# Altium project ReceiverSide.PrjPcb
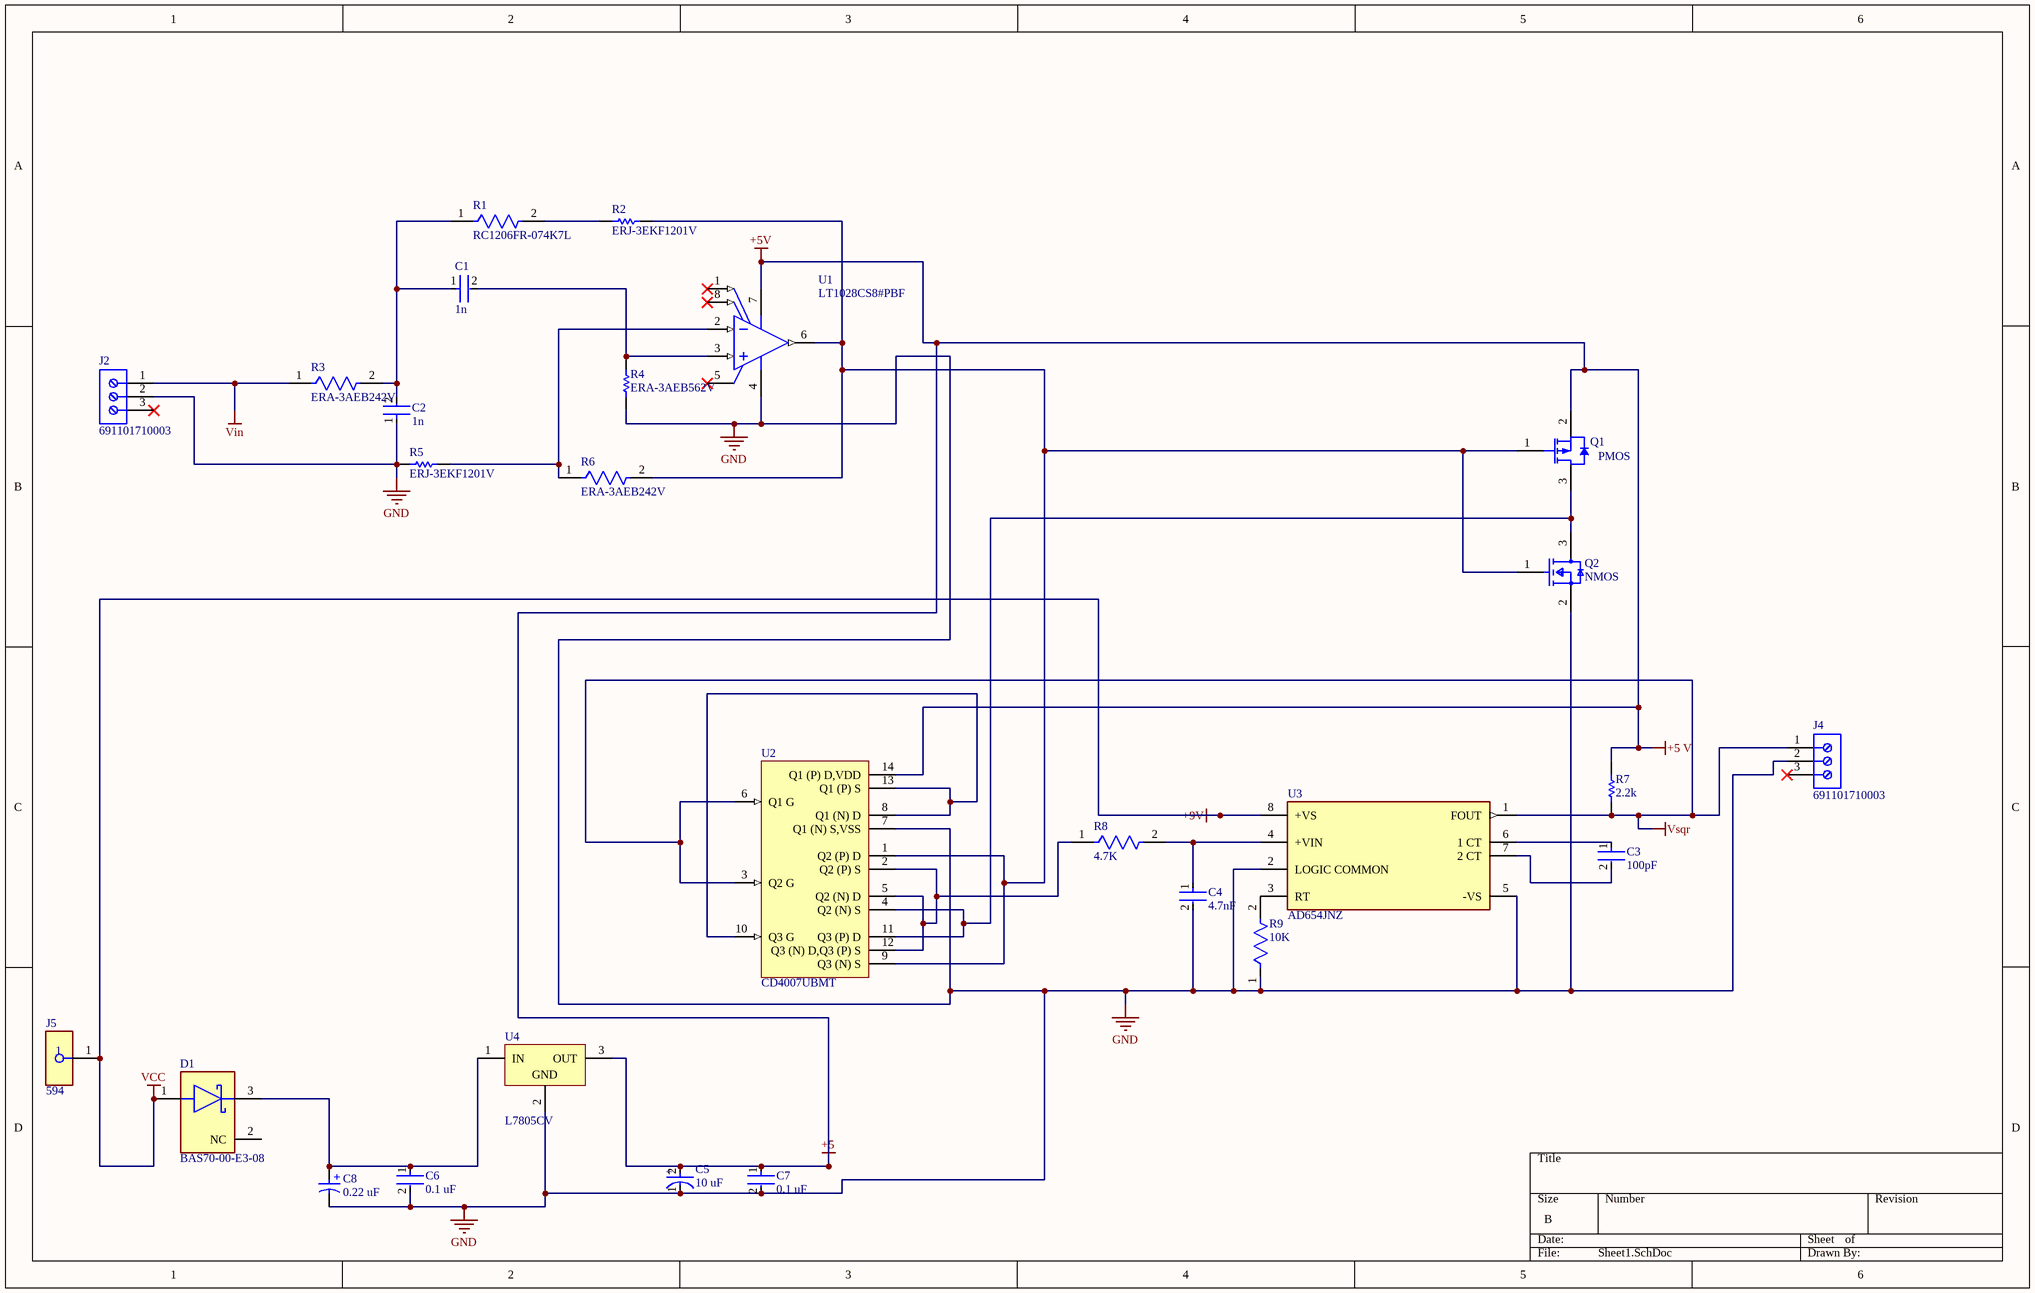
[diagram p0: Sheet1.SchDoc]
1 sheet, 27 parts. Net scope: global (net labels, ports and power ports of the same name join across sheets).
Board file: PCB1.PcbDoc

## Sheet Sheet1.SchDoc
size B; SheetNumber: 1; SheetTotal: 1

### Parts
C1  1n  [FP-0603-L_1_6_0_15-W_0_81-IPC_A]
C2  1n  [FP-0603-L_1_6_0_15-W_0_81-IPC_A]
C3  100pF  [FP-C0402-BB-MFG]
C4  4.7nF  [FP-1206-L_3_2_0_2-W_1_6_0-IPC_B]
C5  10 uF  [FP-RAD-TH-D_5_0_5-L_11_1-MFG]
C6  0.1 uF  [FP-RDE0P1-MFG]
C7  0.1 uF  [FP-RDE0P1-MFG]
C8  0.22 uF  [WCAP-ATG8_D5H11]
D1  BAS70-00-E3-08  [FP-6_541-5014_01-4-MFG]
J2  691101710003  [691101710003]
J4  691101710003  [691101710003]
J5  594  [FP-594-MFG]
Q1  PMOS  [INF-SOT23_L]
Q2  NMOS  [FP-318-08-IPC_B]
R1  RC1206FR-074K7L  [FP-RC1206-0_65-IPC_B]
R2  ERJ-3EKF1201V  [RESC1609X55X30ML15T15]
R3  ERA-3AEB242V  [FP-ERA3A-MFG]
R4  ERA-3AEB562V  [RESC1608X55X30NL20T20]
R5  ERJ-3EKF1201V  [RESC1609X55X30ML15T15]
R6  ERA-3AEB242V  [FP-ERA3A-MFG]
R7  2.2k  [RESC1608X55X25LL10T15]
R8  4.7K  [FP-CRCW0402-e3-IPC_A]
R9  10K  [FP-ERA3A-IPC_C]
U1  LT1028CS8#PBF  [LT-S8-8_M]
U2  CD4007UBMT  [D0014A_N]
U3  AD654JNZ  [FP-N-8-MFG]
U4  L7805CV  [TO220]

### Nets
+5: C5.2(A) C7.1 Q1.2(SOURCE) R7.2 U1.7(V+) U2.14(Q1_(P)_D,VDD) U4.3(OUT)  [also labelled +5 V, +5V]
+9V: D1.1(A) J5.1 U3.8(+VS)  [also labelled VCC]
GND: C2.1 C4.2 C5.1(C) C6.2 C7.2 C8.2(N) J2.2 J4.2 Q2.2(S) R4.1 R5.1 R9.1 U1.4(V-) U2.7(Q1_(N)_S,VSS) U3.2(LOGIC_COMMON) U3.5(-VS) U4.2(GND)
Vin: J2.1 R3.1
Vsqr: J4.1 R7.1 U2.3(Q2_G) U2.6(Q1_G) U3.1(FOUT)
NetC1_1: C1.1 C2.2 R1.1 R3.2
NetC1_2: C1.2 R4.2 U1.3(+IN)
NetC3_1: C3.1 U3.6(1_CT)
NetC3_2: C3.2 U3.7(2_CT)
NetC4_1: C4.1 R8.2 U3.4(+VIN)
NetC6_1: C6.1 C8.1(P) D1.3(C) U4.1(IN)
NetQ1_1: Q1.1(GATE) Q2.1(G) R2.2 R6.2 U1.6(OUT) U2.1(Q2_(P)_D) U2.9(Q3_(N)_S)
NetQ1_3: Q1.3(DRAIN) Q2.3(D) U2.4(Q2_(N)_S) U2.11(Q3_(P)_D)
NetR1_2: R1.2 R2.1
NetR5_2: R5.2 R6.1 U1.2(-IN)
NetR8_1: R8.1 U2.2(Q2_(P)_S) U2.5(Q2_(N)_D) U2.12(Q3_(N)_D,Q3_(P)_S)
NetR9_2: R9.2 U3.3(RT)
NetU2_8: U2.8(Q1_(N)_D) U2.10(Q3_G) U2.13(Q1_(P)_S)

Not connected (* = marked no-connect by the designer): D1 2(NC); J2 3*; J4 3*; U1 1(VOS_TRIM)* 5(OVERCOMP)* 8(VOS_TRIM)*

### Notes on the sheet
- (in symbol CMP-03913-54007281-1) +
- (in symbol CMP-05427-001295-1) +

### Library data of the parts
C1 C2 = CMP-2006-04378-2: General Purpose Ceramic Capacitor, 0603, 1nF, 10%, X7R, 15%, 50V; Case Code (Metric): 1608; Min Operating Temperature: -55°C; Weight: 7.1E-05oz; Series: -; Capacitance: 1nF; RoHS Compliant: Yes; Radiation Hardening: No; Height: 0.9mm; Mount: Surface Mount; REACH SVHC: No SVHC; Lead Free: Lead Free; Depth: 0.81mm; Voltage: 50V; Number of Pins: 2; Voltage Rating: 50V; Max Operating Temperature: 125°C; Termination: SMD/SMT; Construction: Flat; Case Code (Imperial): 0603; Dielectric: X7R; Width: 0.032inch; Tolerance: 10%; Case/Package: 0603; Contact Plating: Tin; Packaging: Tape and Reel; Voltage Rating (DC): 50V; Dielectric Material: Ceramic; Package Quantity: 4000; Thickness: 0.035inch; Length: 1.6mm
C3 = CMP-2008-03050-3: CAP CER 100PF 50V 10% NP0 0402; Manufacturer Part Number: C0402C101K5GACTU; Manufacturer: Kemet; Tolerance: 0.1; Temperature Coefficient: 15%; Temperature Characteristic: C0G; Material: Ceramic; Automotive: No; Temperature Range High: +125°C; Device Class L3: Ceramic Capacitors; ComponentLink2Description: Datasheet; Temperature Range Low: -55°C; Height: 0.55mm; Package: C0402-BB; Capacitance: 100 pF; Digikey Description: CAP CER 100PF 50V 10% NP0 0402; RoHS: TRUE; Mouser Description: KEMET - C0402C101K5GACTU - CAP, C0G / NP0, 100PF, 50V, 0402; ComponentLink2URL: https://content.kemet.com/datasheets/KEM_C1002_X7R_SMD.pdf; Value: 100 pF; Category: Cap; Device Class L1: Passive Components; Octopart: https://octopart.com/c0402c101k5gactu-kemet-9144183; Device Class L2: Capacitors; Ipc Land Pattern Name: CAPC10050X50; Temperature: -55°C to +125°C; Voltage Rating: 50 V; Lead Free: Yes
C4 = CMP-04427-001905-1: General Purpose Ceramic Capacitor, 1206, 4.7nF, 10%, X7R, 15%, 100V; Insulation Resistance: 100GR; Dissipation Factor: 2.5%; Case Code (Imperial): 1206; Length: 3.2mm; Voltage Rating: 100V; Packaging: Tape and Reel; Max Operating Temperature: 125°C; Voltage: 100V; Depth: 1.6mm; Weight: 0.000571oz; Capacitance: 4.7nF; Case/Package: 1206; Tolerance: 10%; Number of Pins: 2; Mount: Surface Mount; Min Operating Temperature: -55°C; Lead Free: Lead Free; Thickness: 0.037inch; RoHS Compliant: Yes; Height: 0.94mm; Radiation Hardening: No; Termination: SMD/SMT; Dielectric Material: Ceramic; Dielectric: X7R; Package Quantity: 1; Voltage Rating (DC): 100V; REACH SVHC: No SVHC; Case Code (Metric): 3216; Width: 0.063inch
C5 = CMP-05427-001295-1: Aluminum Electrolytic Capacitors (Radial Lead Type) 10uF ±20% 50V; Lead Diameter: 0.5mm; Life (Hours): 5000Hour; Impedance: 340mR; Ripple Current (AC): 250mA; REACH SVHC: Yes; Tolerance: 20%; Construction: RADIAL; Min Operating Temperature: -40°C; Termination: Radial; Voltage Rating: 50V; Height: 11mm; Max Operating Temperature: 105°C; Capacitance: 10uF; Voltage: 50V; Diameter: 5mm; Lead Pitch: 2mm; Series: FR Radial; RoHS Compliant: Yes; Case/Package: Radial
C6 C7 = CMP-06035-036375-1: Ceramic Capacitor 100nF ±10% 25V X7R Radial; Lead Diameter: 0.5mm; Mount: Through Hole; Resistor Type: Ceramic; Case/Package: Radial; Height - Seated (Max): 0.236inch; Lead Pitch: 0.098inch; Lead Free: Lead Free; Voltage Rating (DC): 25V; Width: 0.098inch; Packaging: Bulk; Dielectric: X7R; Tolerance: 10%; Min Operating Temperature: -55°C; Capacitance: 100nF; Max Operating Temperature: 125°C; Termination: Radial; Height: 3.5mm; Package Quantity: 500; Voltage Rating: 25V; Length: 0.197inch
C8 = CMP-03913-54007281-1: 860010772002 WCAP-ATG8 Aluminum Electrolytic Capacitors; Polarity: Polar; Voltage Rating: 63V; Dissipation Factor: 9%; Tolerance: 20%; Capacitance: 220nF; Leakage Current: 3µA; Pitch: 2mm; Life (Hours): 2000hours; Ripple Current: 4mA; Diameter: 5mm; NexarPartId: 54007281; RoHS: Compliant; Lead Pitch: 2.0066mm; Min Operating Temperature: -40°C; Max Operating Temperature: 85°C; Case/Package: Radial; Height - Seated (Max): 12.4968mm; Mount: Through Hole; Height: 11mm; REACH SVHC: Unknown; Voltage Rating (DC): 63V; Length: 11mm; Packaging: Tape & Box (TB)
D1 = CMP-02539-000005-1: DIODE SCHOTTKY 70V 200MA SOT23; Manufacturer: Vishay; Max Surge Forward Current: 600mA; Peak Reverse Current: 0.02uA; Value: 1.5pF; Max Junction Temp: +125°C; Temperature Range High: +125°C; Device Class L1: Discrete Semiconductors; Height: 1.15mm; Temperature: -55°C to +125°C; Mouser Description: Schottky Diodes & Rectifiers 70 Volt 200mA Single; Manufacturer Part Number: BAS70-00-E3-08; Reverse Voltage: 70V; Device Class L3: Schottky Diodes; Temperature Range Low: -55°C; Package: 6.541-5014.01-4; RoHS: TRUE; Automotive: No; Capacitance: 1.5pF; Max Repetitive Reverse Voltage: 70V; ComponentLink2URL: https://www.vishay.com/docs/85702/bas70.pdf; Category: Diode; Octopart: https://octopart.com/bas70-00-e3-08-vishay-30324832; Forward Current: 200mA; Lead Free: Yes; Device Class L2: Diodes; Digikey Description: DIODE SCHOTTKY 70V 200MA SOT23; ComponentLink2Description: Datasheet
J2 J4 = CMP-1502-03257-2: NexarPartId: 8917705; Voltage Rating: 250V; Current: 16A; Wire Gauge (Min): 14AWG; Pitch: 5.0038mm; Wire Gauge (Max): 26AWG; Number of Positions Per Level: 3; Plating: Steel; Number of Levels: 1; Stripping Length: -7mm; REACH SVHC: Unknown; Width: 16.2mm; Height: 16.4mm; Contact Material: Brass; RoHS: Compliant; Color: Blue; Contact Plating: Tin; Lead Pitch: 5mm; Packaging: Box; Termination: Screw; Number of Contacts: 3; Wire/Cable Gauge: 26AWG; Min Operating Temperature: -40°C; Max Operating Temperature: 105°C; Housing Material: Nylon; Length: 9mm; Voltage: 250V; Mount: Through Hole; Current Rating: 16A; Number of Pins: 3
J5 = CMP-19636-000029-1: BATTERY CONTACT SNAP 9V PC PIN; Body Material: Steel; Material Thickness: 0.15inch; Connector Type: Snap in; Number of Cells: 1; Gender: Female; Body Plating: Tin; Package Quantity: 100; Termination: PC Pin; Thickness: 0.015inch; Reach SVHC Compliant: Yes; RoHS Compliant: Yes; Length: 9.65mm; Contact Plating: Nickel; Contact Type: Snap-In; Material: Steel; Packaging: Bulk; Orientation: Right Angle; Mount: Through Hole; Lead Free: Lead Free; Series: -; Number of Batteries: 1; Contact Material: Steel
Q1 = CMP-2000-05970-1: SIPMOS(R) Small-Signal-Transistor, -0.33 A, 2 Ohm, -60 V, 3-Pin SOT-23, RoHS, Tape and Reel; Manufacturer: Infineon; Package Version: 04/2016; Mounting Technology: SurfaceMount; Manufacturer URL: http://www.infineon.com/; RoHS: Details; Package Description: 3-Pin Small Outline Transistor Package, Body 2.9 x 1.3 mm, Pitch 0.95 mm; Product Category: MOSFET; Datasheet Version: Rev. 1.5, 03/2012; Package Reference: SOT23; Package URL: http://www.infineon.com/dgdl/Infineon-PG-SOT23-3-5_BSS83PH6327XTSA1-PD-v01_00-EN.pdf?fileId=5546d46254e133b40154f1b7e80354af; Packaging: Reel; Datasheet URL: http://media.digikey.com/pdf/Data%20Sheets/Infineon%20PDFs/BSS83P%20H6327.pdf
Q2 = CMP-07173-000101-1: MOSFET N-CH 50V 220MA SOT-23; Turn-Off Delay Time: 20ns; Element Configuration: Single; Rds On Max: 3.5R; Gate to Source Voltage (Vgs): 20V; Threshold Voltage: 1.3V; Number of Elements: 1; Power Dissipation: 360mW; Rise Time: 9ns; Turn-On Delay Time: 2.5ns; Input Capacitance: 27pF; On-State Resistance: 6R; Lead Free: Lead Free; Length: 2.92mm; Width: 1.3mm; Drain to Source Breakdown Voltage: 50V; Min Operating Temperature: -55°C; REACH SVHC: No SVHC; Packaging: Tape and Reel; Radiation Hardening: No; Height: 0.93mm; Drain to Source Voltage (Vdss): 50V; Current Rating: 220mA; Voltage Rating (DC): 50V; Weight: 0.03g; Continuous Drain Current (ID): 220mA; Number of Pins: 3; Nominal Vgs: 1.3V; Max Power Dissipation: 360mW; Fall Time: 9ns; Drain to Source Resistance: 3.5R; Contact Plating: Tin; Case/Package: SOT-23; Package Quantity: 1; Dual Supply Voltage: 50V; Mount: Surface Mount; Termination: SMD/SMT; Max Operating Temperature: 150°C
R1 = CMP-03412-037805-1: RES SMD 4.7K OHM 1% 1/4W 1206; Max Power Dissipation: 250mW; Voltage Rating: 200V; Temperature Coefficient: 100ppm/°C; Resistance: 4.7kR; Construction: Rectangular; RoHS Compliant: Yes; Max Operating Temperature: 155°C; Tolerance: 1%; Height: 0.026inch; Features: Moisture Resistant; Military Standard: Not; Series: RC; Termination: SMD/SMT; Number of Terminations: 2; Number of Pins: 2; Case Code (Imperial): 1206; Case/Package: 1206; Case Code (Metric): 3216; Voltage Rating (DC): 200V; Width: 0.063inch; Min Operating Temperature: -55°C; Resistance Tolerance: 1%; Length: 0.122inch; Size Code: 1206; Lead Free: Lead Free; Depth: 1.6mm; Packaging: Tape and Reel; Package Quantity: 1; Power Rating: 250mW; Resistor Type: Thick Film
R2 R5 = CMP-2000-00214-2: Chip Resistor, 1.2 KOhm, +/- 1%, 0.1 W, -55 to 155 degC, 0603 (1608 Metric), RoHS, Tape and Reel; Manufacturer: Panasonic; Max Power Dissipation: 100mW; Voltage Rating (DC): 75V; Temperature Coefficient: 100ppm/degC; Package Description: 2-Pin Surface Mount Device, Body 1.6 x 0.85 mm; Contact Plating: Tin; Number of Pins: 2; Resistance: 1.2KOhm; Length: 1.6mm; Height: 0.022inch; Number of Terminations: 2; Mount: SurfaceMount; Package Reference: 0603; Packaging: TapeandReel; Case Code (Metric): 1608; Datasheet Version: 42095.0; Datasheet URL: https://industrial.panasonic.com/cdbs/www-data/pdf/RDA0000/AOA0000C283.pdf; Depth: 0.8mm; REACH SVHC: NoSVHC; Case/Package: 0603; Min Operating Temperature: -55degC; Composition: ThickFilm; Manufacturer URL: http://www.panasonic.com/; Termination: SMD/SMT; Package Quantity: 1; Case Code (Imperial): 0603; Width: 0.031inch; Power Rating: 100mW; Voltage Rating: 75V; Lead Free: LeadFree; Package URL: http://www.st.com/st-web-ui/static/active/en/resource/technical/document/datasheet/CD00001320.pdf; RoHSCompliant: True; Tolerance: 1%; Military Standard: Not; Max Operating Temperature: 155degC
R3 R6 = CMP-2000-00965-2: NexarPartId: 1173624; Resistance: 2.4kΩ; Voltage Rating: 75V; Max Power Dissipation: 100mW; Temperature Coefficient: 25ppm/°C; Tolerance: 0.1%; Schedule B: 8533210045, 8533210045; Packaging: Tape & Reel; Case/Package: 0603; Power Rating: 100mW; Composition: Thin Film; Lead Free: Lead Free; Military Standard: Not; REACH SVHC: No SVHC; Radiation Hardening: No; Length: 1.6mm; Max Operating Temperature: 155°C; Number of Pins: 2; Height: 450µm; Mount: Surface Mount; Case Code (Metric): 1608; RoHS: Compliant; Termination: SMD/SMT; Width: 800µm; Min Operating Temperature: -55°C; Voltage Rating (DC): 75V; Depth: 800µm; Case Code (Imperial): 0603; Lifecycle Status: Production; Contact Plating: Tin; Number of Terminations: 2
R4 = CMP-2000-00094-1: Manufacturer: Panasonic; Part Number: ERA-3AEB562V
R7 = CMP-2000-06934-1: Thick Film Resistor, 2.2 KOhm, 100 mW, 50 V, +/- 1%, -55 to 155 degC, 2-Pin SMD (0603), RoHS, Tape and Reel; Manufacturer: Yageo; Resistance: 2.2kOhms; Temperature Coefficient: 100PPM/C; Voltage Rating: 50V; Power Rating: 100mW; Tolerance: 1%; Datasheet Version: Rev. 7, 05/2017; Case Code - mm: 1608; Series: RC; Mounting Technology: SurfaceMount; Package Description: 2-Pin Surface Mount Device, Body 1.6 x 0.8 mm; Case Code - in: 0603; Package Reference: 0603; Product: ThickFilmResistorsGeneralPurpose; Manufacturer URL: http://www.yageo.com/; Termination Style: SMD/SMT; Operating Temperature Range: -55Cto+155C; Datasheet URL: http://www.yageo.com/documents/recent/PYu-RC_Group_51_RoHS_L_7.pdf; Packaging: Reel
R8 = CMP-2002-00052-3: RES Thick Film, 4.7kΩ, 5%, 0.063W, 200ppm/°C, 0402; Power Rating: 63mW; Resistance: 4.7kR; Voltage Rating: 50V; Case Code (Metric): 1005; Case/Package: 0402; Composition: Thick Film; Depth: 0.5mm; Min Operating Temperature: -55°C; Temperature Coefficient: 200ppm/°C; Max Power Dissipation: 63mW; Packaging: Tape and Reel; Max Operating Temperature: 155°C; Number of Terminations: 2; Width: 0.5mm; Height: 0.35mm; Contact Plating: Tin; Package Quantity: 1; Length: 1mm; Termination: SMD/SMT; Radiation Hardening: No; Weight: 2.3E-05oz; Military Standard: Not; Case Code (Imperial): 0402; Features: Automotive AEC-Q200; Tolerance: 5%
R9 = CMP-2000-00874-2: RES SMD 10K OHM 0.1% 1/10W 0603; Voltage Rating (DC): 75V; Power Rating: 100mW; Resistance: 10kR; Temperature Coefficient: 25ppm/°C; Radiation Hardening: No; Width: 0.8mm; Depth: 0.8mm; Construction: Rectangular; Case Code (Metric): 1608; Package Quantity: 5000; Length: 1.6mm; Size Code: 0603; Case Code (Imperial): 0603; Termination: SMD/SMT; Contact Plating: Tin; Resistance Tolerance: 0.1%; Military Standard: Not; Packaging: Tape and Reel; Max Power Dissipation: 100mW; REACH SVHC: No SVHC; Series: ERA-3A; Voltage Rating: 75V; Lead Free: Lead Free; Technology: METAL FILM; RoHS Compliant: Yes; Max Operating Temperature: 155°C; Resistor Type: Thin Film; Min Operating Temperature: -55°C; Number of Pins: 2; Case/Package: 0603; Tolerance: 0.1%; Height: 0.45mm; Mount: Surface Mount; Number of Terminations: 2
U1 = CMP-0359-03082-2: Single Channel, Low Noise, Low Drift Operational Amplifier, 75 MHz Typical GBW, 15 V/us Typical SR, 8 to 44 V, 8-Pin SOIC (S8-8), Commerical, Pb-Free; Linear Technology Part Number: LT1028; Manufacturer: Linear Technology; Is (mA) Typical: 7.4; Channels (#): 1; GBW (MHz) Typical: 75; Vs Min (V): 8; SR (V/us) Typical: 15; Vs Max (V): 44; Vos (mV) Typical: 0.01; ComponentLink2Description: Datasheet; PackageDescription: 8-Pin Plastic Small Outline, Body 4.9 x 3.9 mm, Pitch 1.27 mm; DatasheetVersion: Rev. B; ComponentLink3URL: http://cds.linear.com/docs/en/packaging/05081610_G_SO8.pdf; ComponentLink3Description: Package Specification; ComponentLink2URL: http://cds.linear.com/docs/en/datasheet/1028fb.pdf; RevisionNote: URLs updated; PackageReference: LT-S8-8; Type: VFB; RoHS: Pb-Free; Mounting Technology: Surface Mount; PackageVersion: Rev G; ComponentLink1Description: Manufacturer URL; ComponentLink1URL: http://www.linear.com/; PartNumber: LT1028CS8#PBF
U2 = CMP-1632-00001-2: CMOS Dual Complementary Pair Plus Inverter, D0014A, SMALL T&R; Manufacturer: Texas Instruments; VCC(Min)(V): 3; F @ Nom Voltage(Max)(Mhz): 8; Rating: Catalog; Technology Family: CD4000; Bits(#): 2; Voltage(Nom)(V): 10; VCC(Max)(V): 18; tpd @ Nom Voltage(Max)(ns): 60; ICC @ Nom Voltage(Max)(mA): 0.015; Output Drive (IOL/IOH)(Max)(mA): 4/-4; Schmitt Trigger: No; PackageReference: D0014A; Input Type: CMOS; Operating Temperature Range(C): -55 to 125; Output Type: CMOS; Code_JEDEC: MS-012; DatasheetVersion: SCHS018C; Generic Part Number: CD4007UB
U3 = CMP-09081-000046-1: IC V/F CONV 500KHZ 8DIP; Operating Supply Voltage: 28V; Min Supply Voltage: 4.5V; Supply Current: 2.5mA; Max Input Voltage: 14V; Dual Supply Voltage: 9V; Min Dual Supply Voltage: 5V; Max Supply Voltage: 36V; Accuracy: 0.4%; Max Dual Supply Voltage: 18V; Linearity: 0.2%; Max Output Current: 20mA; Supply Type: Dual; RoHS Compliant: Yes; Operating Supply Current: 2.5mA; Number of Pins: 8; Min Operating Temperature: -40°C; Radiation Hardening: No; Max Frequency: 500kHz; Packaging: Rail/Tube; Max Operating Temperature: 85°C; Case/Package: PDIP; Width: 7.24mm; Height: 3.43mm; Nominal Supply Current: 2.5mA; Lead Free: Contains Lead; Contact Plating: Tin; Frequency: 500kHz; Series: -; Mount: Through Hole; Length: 9.27mm; Max Output Voltage: 18V; Weight: 0.032805oz; Bandwidth: 500kHz; REACH SVHC: No SVHC
U4 = CMP-0244-00483-1: Positive Voltage Regulator, 5V, 3-Pin TO-220; PackageDescription: TO, Thru-Hole, Vertical, Heatsink Mounted; 3 In-Line Leads; Pitch 2.54 mm; ComponentLink2Description: Datasheet; PackageReference: TO220; ComponentLink3URL: http://www.st.com/internet/com/TECHNICAL_RESOURCES/TECHNICAL_LITERATURE/PACKAGE_INFORMATION/CD00004649.pdf; DatasheetVersion: 16/11/2011; ComponentLink1Description: Manufacturer URL; ComponentLink1URL: http://www.st.com; PackageVersion: ver3.0; ComponentLink3Description: Package Specification; ComponentLink2URL: http://www.st.com/internet/com/TECHNICAL_RESOURCES/TECHNICAL_LITERATURE/DATASHEET/CD00000444.pdf